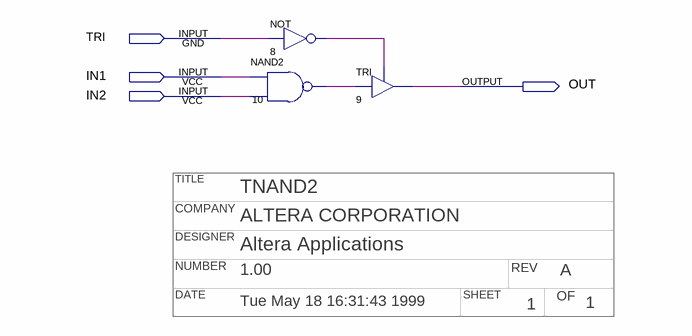
[diagram p0: schematic sheet]
// Quartus schematic tnand2.bdf as structural Verilog: 3 symbols, 4 pins
// Title block: TITLE: TNAND2; COMPANY: ALTERA CORPORATION; DESIGNER: Altera Applications; NUMBER: 1.00; REV: A; DATE: Tue May 18 16:31:43 1999; SHEET: 1; OF: 1
module tnand2 (
  input  TRI,
  input  IN1,
  input  IN2,
  output OUT
);

  wire n8_out, n10_out;

  not u_8 (n8_out, TRI);
  nand u_10 (n10_out, IN1, IN2);
  TRI u_9 (.IN(n10_out), .OE(n8_out), .OUT(OUT));
endmodule
